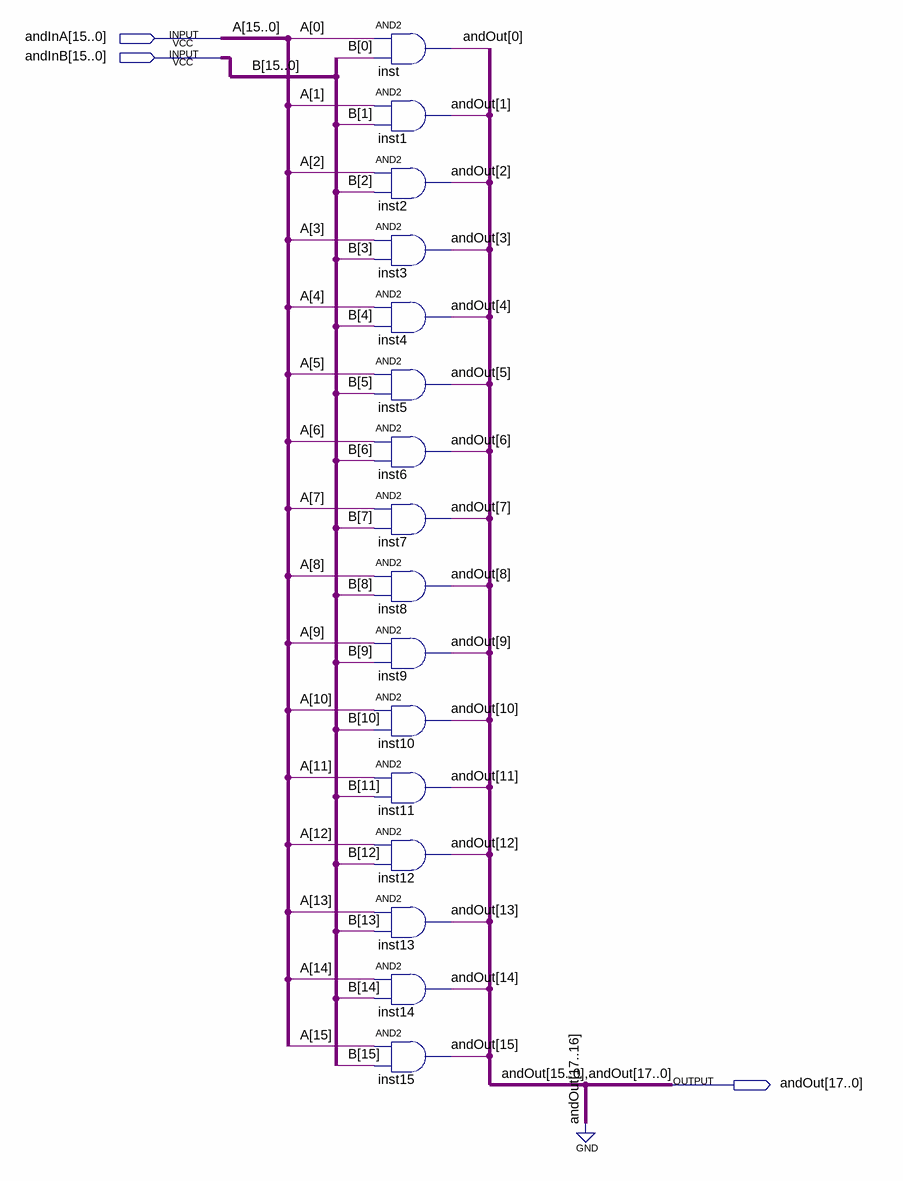
[diagram p0: schematic sheet]
// Quartus schematic and1616.bdf as structural Verilog: 16 symbols, 3 pins
module and1616 (
  input  [15:0] andInA,
  input  [15:0] andInB,
  output [17:0] andOut
);

  and inst (andOut[0], andInA[0], andInB[0]);
  and inst1 (andOut[1], andInA[1], andInB[1]);
  and inst2 (andOut[2], andInA[2], andInB[2]);
  and inst3 (andOut[3], andInA[3], andInB[3]);
  and inst4 (andOut[4], andInA[4], andInB[4]);
  and inst5 (andOut[5], andInA[5], andInB[5]);
  and inst6 (andOut[6], andInA[6], andInB[6]);
  and inst7 (andOut[7], andInA[7], andInB[7]);
  and inst8 (andOut[8], andInA[8], andInB[8]);
  and inst9 (andOut[9], andInA[9], andInB[9]);
  and inst10 (andOut[10], andInA[10], andInB[10]);
  and inst11 (andOut[11], andInA[11], andInB[11]);
  and inst12 (andOut[12], andInA[12], andInB[12]);
  and inst13 (andOut[13], andInA[13], andInB[13]);
  and inst14 (andOut[14], andInA[14], andInB[14]);
  and inst15 (andOut[15], andInA[15], andInB[15]);

  assign andOut[17:16] = 2'b00;

  // Other names for the same wires on the sheet: A[15:0] = andInA; B[15:0] = andInB
endmodule
